# EAGLE schematic RPi Lego Server Slave Plane Idea (EAGLE 7.2.0)
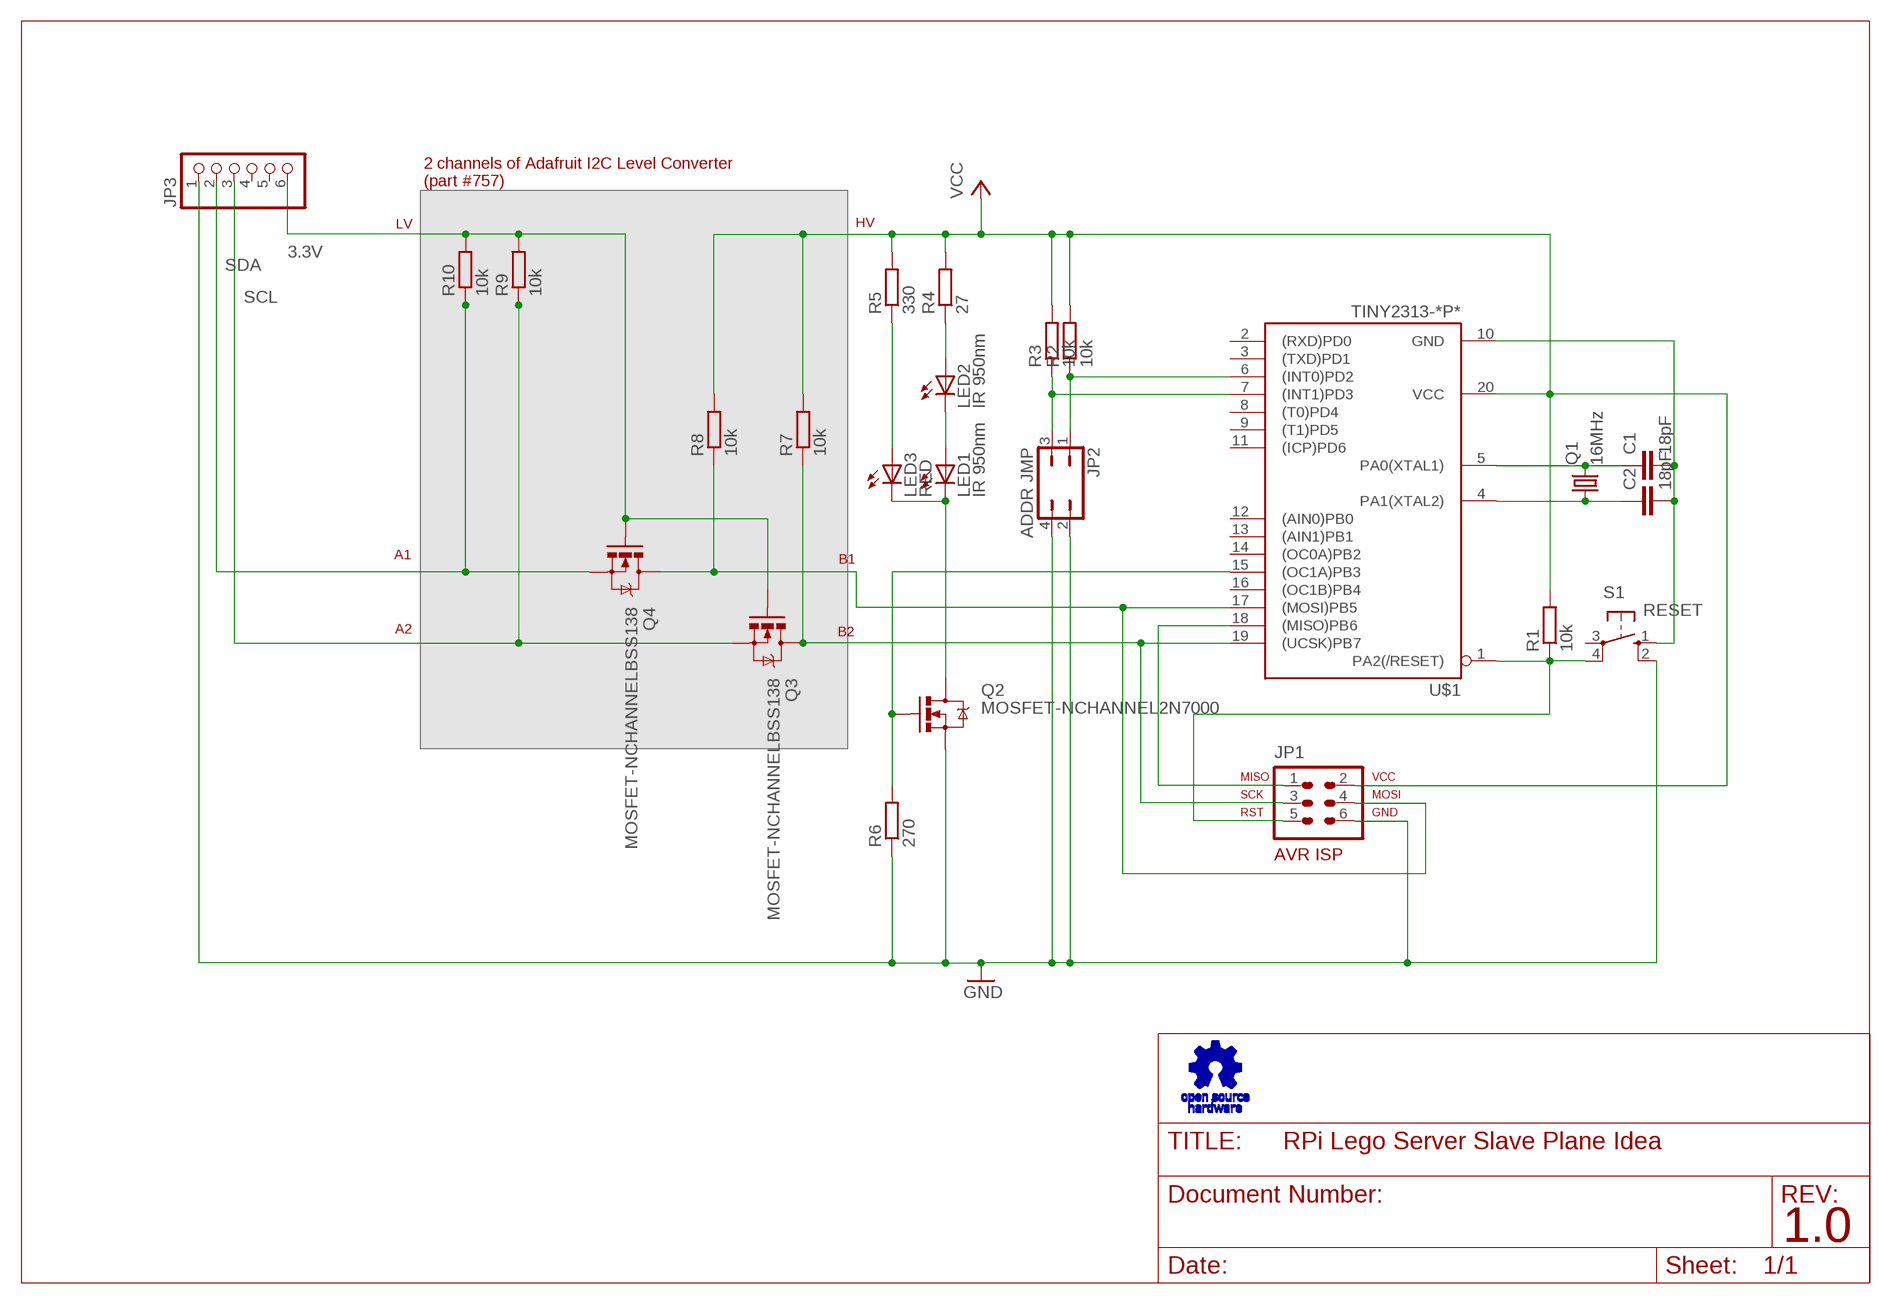
[diagram p0: schematic, sheet 1]

## Parts
C1  18pF  C-EU025-025X050  [C025-025X050]
C2  18pF  C-EU025-025X050  [C025-025X050]
JP1  AVR-ISP-6VERT  [AVR-ISP-6]
JP2  ADDR JMP  JP2Q  [JP2Q]
JP3  PINHD-1X6  [1X06]
LED1  IR 950nm  LED5MM  [LED5MM]
LED2  IR 950nm  LED5MM  [LED5MM]
LED3  RED  LED3MM  [LED3MM]
Q1  16MHz  CRYSTALHC49S  [HC49/S]
Q2  MOSFET-NCHANNEL2N7000  [TO-92]
Q3  MOSFET-NCHANNELBSS138  [SOT23-3]
Q4  MOSFET-NCHANNELBSS138  [SOT23-3]
R1  10k  R-EU_0207_10  [0207/10]
R2  10k  R-EU_0207_10  [0207/10]
R3  10k  R-EU_0207_10  [0207/10]
R4  27  R-EU_0207_10  [0207/10]
R5  330  R-EU_0207_10  [0207/10]
R6  270  R-EU_0207_10  [0207/10]
R7  10k  R-EU_0207_10  [0207/10]
R8  10k  R-EU_0207_10  [0207/10]
R9  10k  R-EU_0207_10  [0207/10]
R10  10k  R-EU_0207_10  [0207/10]
S1  RESET  10-XX  [B3F-10XX]
U$1  TINY2313-*P*  [DIL20]

## Nets
3.3V: JP3.6 Q3.1(G) Q4.1(G) R9.2 R10.2
GND: JP1.6 JP2.2 JP2.4 Q2.1(S) R6.1 S1.2(S1)
N$1: JP1.5 R1.1 S1.4(P1) U$1.1(PA2(/RESET))
N$2: C1.2 C2.2 S1.1(S) U$1.10(GND)
N$3: JP2.1 R2.1 U$1.6((INT0)PD2)
N$4: C1.1 Q1.2 U$1.5(PA0(XTAL1))
N$5: C2.1 Q1.1 U$1.4(PA1(XTAL2))
N$6: JP1.1 U$1.18((MISO)PB6)
N$7: JP1.3 Q3.3(D) R7.1 U$1.19((UCSK)PB7)
N$8: JP2.3 R3.1 U$1.7((INT1)PD3)
N$10: JP1.4 Q4.3(D) R8.1 U$1.17((MOSI)PB5)
N$12: LED2.A R4.1
N$13: LED3.A R5.1
N$14: LED1.A LED2.K(C)
N$15: LED1.K(C) LED3.K(C) Q2.3(D)
N$17: Q2.2(G) R6.2 U$1.15((OC1A)PB3)
SCL: Q3.2(S) R9.1
SDA: JP3.2 Q4.2(S) R10.1
VCC: JP1.2 R1.2 R2.2 R3.2 R4.2 R5.2 R7.2 R8.2 U$1.20(VCC)
Unconnected: JP3.1 JP3.3 JP3.4 JP3.5 S1.3(P) U$1.2((RXD)PD0) U$1.3((TXD)PD1) U$1.8((T0)PD4) U$1.9((T1)PD5) U$1.11((ICP)PD6) U$1.12((AIN0)PB0) U$1.13((AIN1)PB1) U$1.14((OC0A)PB2) U$1.16((OC1B)PB4)

## Notes on the sheet
- 2 channels of Adafruit I2C Level Converter
  (part #757)
- LV | HV
- A1
- B1
- A2 | B2
- /Users/xjmaas/Downloads/OSHW_Logo.bmp
- 1.0

## Library data of the parts
C1 C2 = rcl:C-EU: CAPACITOR, European symbol
JP1 = avr-7:AVR-ISP-6: AVR ISP-6 Serial Programming Header
JP2 = jumper:JP2Q: JUMPER
JP3 = pinhead:PINHD-1X6: PIN HEADER
LED1-LED3 = led:LED: LED OSRAM: - CHIPLED LG R971, LG N971, LY N971, LG Q971, LY Q971, LO R971, LY R971 LH N974, LH R974 LS Q976, LO Q976, LY Q976 LO Q996 - Hyper CHIPLED LW Q18S LB Q993, LB Q99A, LB R99A - SideLED LS A670, LO A670, LY A670, LG A670, LP A670 LB A673, LV A673, LT A673, LW A673 LH A674 LY A675 LS A676, LA A676, LO A676, LY A676, LW A676 LS A679, LY A679, LG A679 - Hyper Micro SIDELED® LS Y876, LA Y876, LO Y876, LY Y876 LT Y87S - SmartLED LW L88C, LW L88S LB L89C, LB L89S, LG L890 LS L89K, LO L89K, LY L89K LS L896, LA L896, LO L896, LY L896 - TOPLED LS T670, LO T670, LY T670, LG T670, LP T670 LSG T670, LSP T670, LSY T670, LOP T670, LYG T670 LG T671, LOG T671, LSG T671 LB T673, LV T673, LT T673, LW T673 LH T674 LS T676, LA T676, LO T676, LY T676, LB T676, LH T676, LSB T676, LW T676 LB T67C, LV T67C, LT T67C, LS T67K, LO T67K, LY T67K, LW E67C LS E67B, LA E67B, LO E67B, LY E67B, LB E67C, LV E67C, LT E67C LW T67C LS T679, LY T679, LG T679 LS T770, LO T770, LY T770, LG T770, LP T770 LB T773, LV T773, LT T773, LW T773 LH T774 LS E675, LA E675, LY E675, LS T675 LS T776, LA T776, LO T776, LY T776, LB T776 LHGB T686 LT T68C, LB T68C - Hyper Mini TOPLED® LB M676 - Mini TOPLED Santana® LG M470 LS M47K, LO M47K, LY M47K Source: http://www.osram.convergy.de LUXEON: - LUMILED® LXK2-PW12-R00, LXK2-PW12-S00, LXK2-PW14-U00, LXK2-PW14-V00 LXK2-PM12-R00, LXK2-PM12-S00, LXK2-PM14-U00 LXK2-PE12-Q00, LXK2-PE12-R00, LXK2-PE12-S00, LXK2-PE14-T00, LXK2-PE14-U00 LXK2-PB12-K00, LXK2-PB12-L00, LXK2-PB12-M00, LXK2-PB14-N00, LXK2-PB14-P00, LXK2-PB14-Q00 LXK2-PR12-L00, LXK2-PR12-M00, LXK2-PR14-Q00, LXK2-PR14-R00 LXK2-PD12-Q00, LXK2-PD12-R00, LXK2-PD12-S00 LXK2-PH12-R00, LXK2-PH12-S00 LXK2-PL12-P00, LXK2-PL12-Q00, LXK2-PL12-R00 Source: www.luxeon.com KINGBRIGHT: KA-3528ASYC Source: www.kingbright.com
Q1 = crystal:CRYSTAL: CRYSTAL; OC_FARNELL: 1667008; OC_NEWARK: unknown
Q2 = SparkFun-DiscreteSemi:MOSFET-NCHANNEL: Common NMOSFET Parts MFG P/N Store ID Prod ID FDD8780 TRANS-09984 SI7820DN TRANS-11055 FDS6630A IC-08089 2N7002PW TRANS-11151 FQP30N06L COM-10213 TRANS-10060 BSS123LT1G TRANS-08345 BSS138 TRANS-00830 BS170 2N7000
Q3 Q4 = SparkFun-DiscreteSemi:MOSFET-NCHANNEL: Common NMOSFET Parts MFG P/N Store ID Prod ID FDD8780 TRANS-09984 SI7820DN TRANS-11055 FDS6630A IC-08089 2N7002PW TRANS-11151 FQP30N06L COM-10213 TRANS-10060 BSS123LT1G TRANS-08345 BSS138 TRANS-00830 BS170 2N7000; PROD_ID: TRANS-00830
R1-R10 = resistor:R-EU_: RESISTOR, European symbol; SPICEPREFIX: R
S1 = switch-omron:10-XX: OMRON SWITCH; MPN: B3F-1000; OC_FARNELL: 176432; OC_NEWARK: 36M3542
U$1 = avr-7:TINY2313*: Atmel Tiny2313 2K Flash, 128 bytes EEPROM, 128 bytes RAM